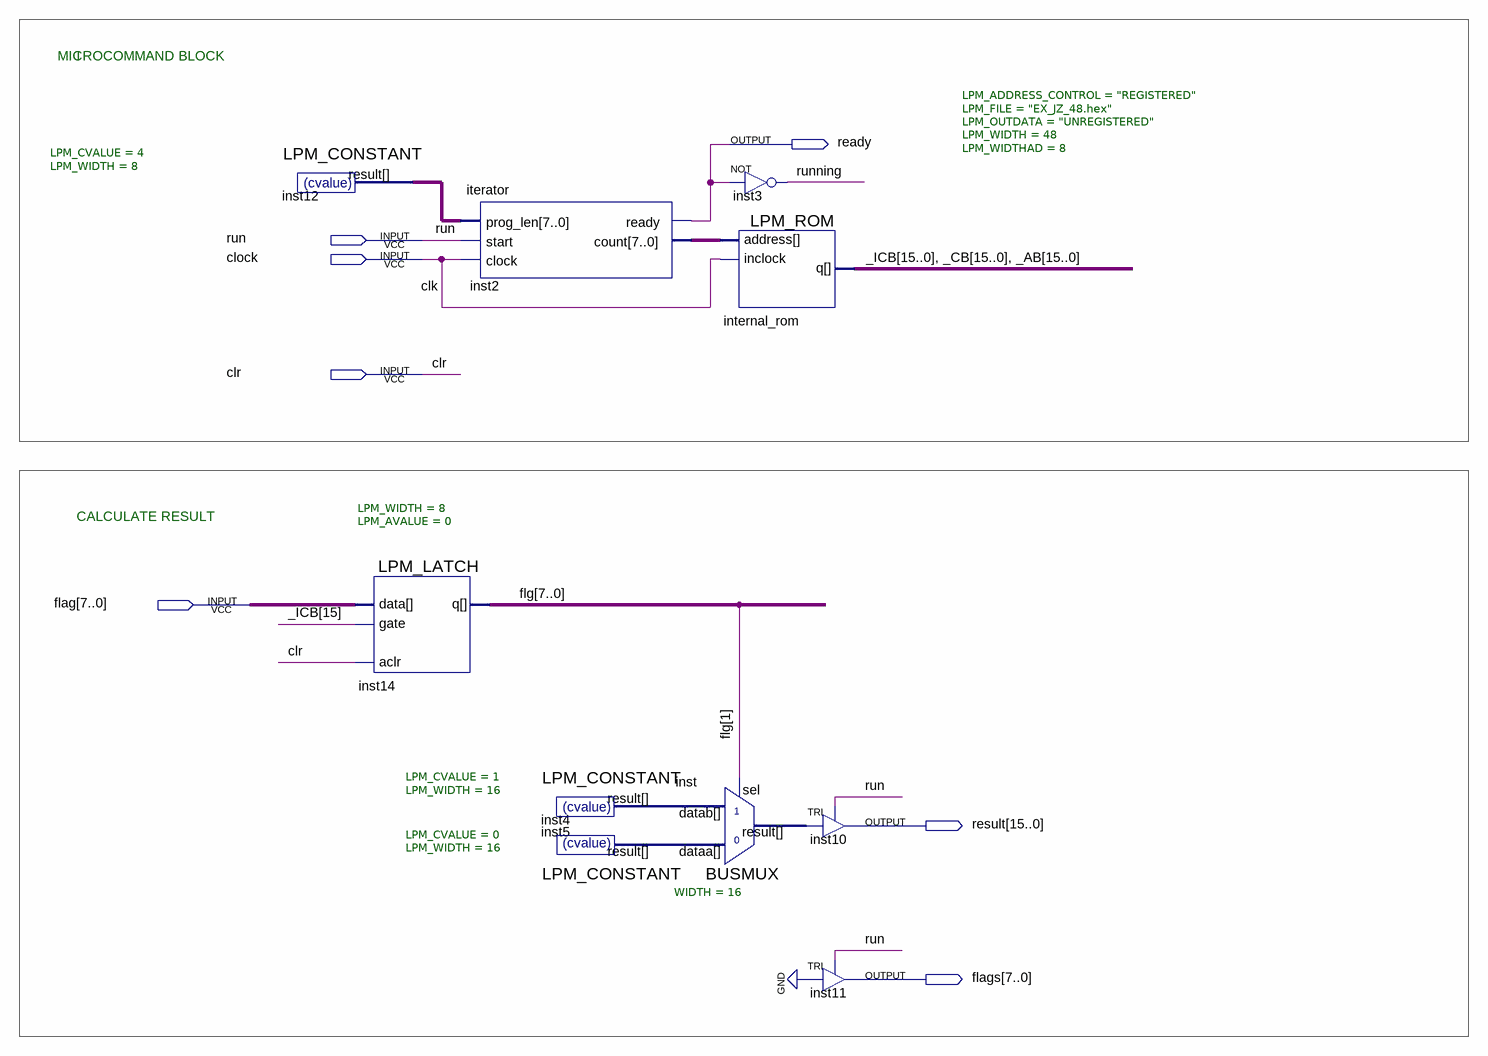
[diagram p0: schematic sheet]
// Quartus schematic EX_JZ.bdf as structural Verilog: 10 symbols, 7 pins
module EX_JZ (
  input  run,
  input  clock,
  input  clr,
  input  [7:0] flag,
  output ready,
  output [15:0] result,
  output [7:0] flags
);

  wire running;
  wire [7:0] flg, inst2_count, inst12_result;
  wire [15:0] _AB, _CB, _ICB, inst4_result, inst5_result, inst_result;

  LPM_CONSTANT #(.LPM_CVALUE(4), .LPM_WIDTH(8)) inst12 (.result(inst12_result));
  LPM_LATCH #(.LPM_WIDTH(8), .LPM_AVALUE(0)) inst14 (.aclr(clr), .data(flag), .gate(_ICB[15]), .q(flg));
  iterator inst2 (.prog_len(inst12_result), .start(run), .clock(clock), .ready(ready), .count(inst2_count));
  LPM_CONSTANT #(.LPM_CVALUE(1), .LPM_WIDTH(16)) inst4 (.result(inst4_result));
  LPM_CONSTANT #(.LPM_CVALUE(0), .LPM_WIDTH(16)) inst5 (.result(inst5_result));
  BUSMUX #(.WIDTH(16)) inst (.datab(inst4_result), .sel(flg[1]), .dataa(inst5_result), .result(inst_result));
  not inst3 (running, ready);
  LPM_ROM #(.LPM_ADDRESS_CONTROL("REGISTERED"), .LPM_FILE("EX_JZ_48.hex"), .LPM_OUTDATA("UNREGISTERED"), .LPM_WIDTH(48), .LPM_WIDTHAD(8)) internal_rom (
    .address(inst2_count), .inclock(clock), .q({_ICB, _CB, _AB}));
  TRI inst10[15:0] (.IN(inst_result), .OE(run), .OUT(result));
  TRI inst11[7:0] (.IN(1'b0), .OE(run), .OUT(flags));

  // Other names for the same wires on the sheet: clk = clock

  // Notes on the sheet:
  //   MICROCOMMAND BLOCK
  //   I
  //   CALCULATE RESULT
endmodule
